# Altium schematic sheet randcomponenten.SchDoc
size A; SheetNumber: 2; SheetTotal: 2
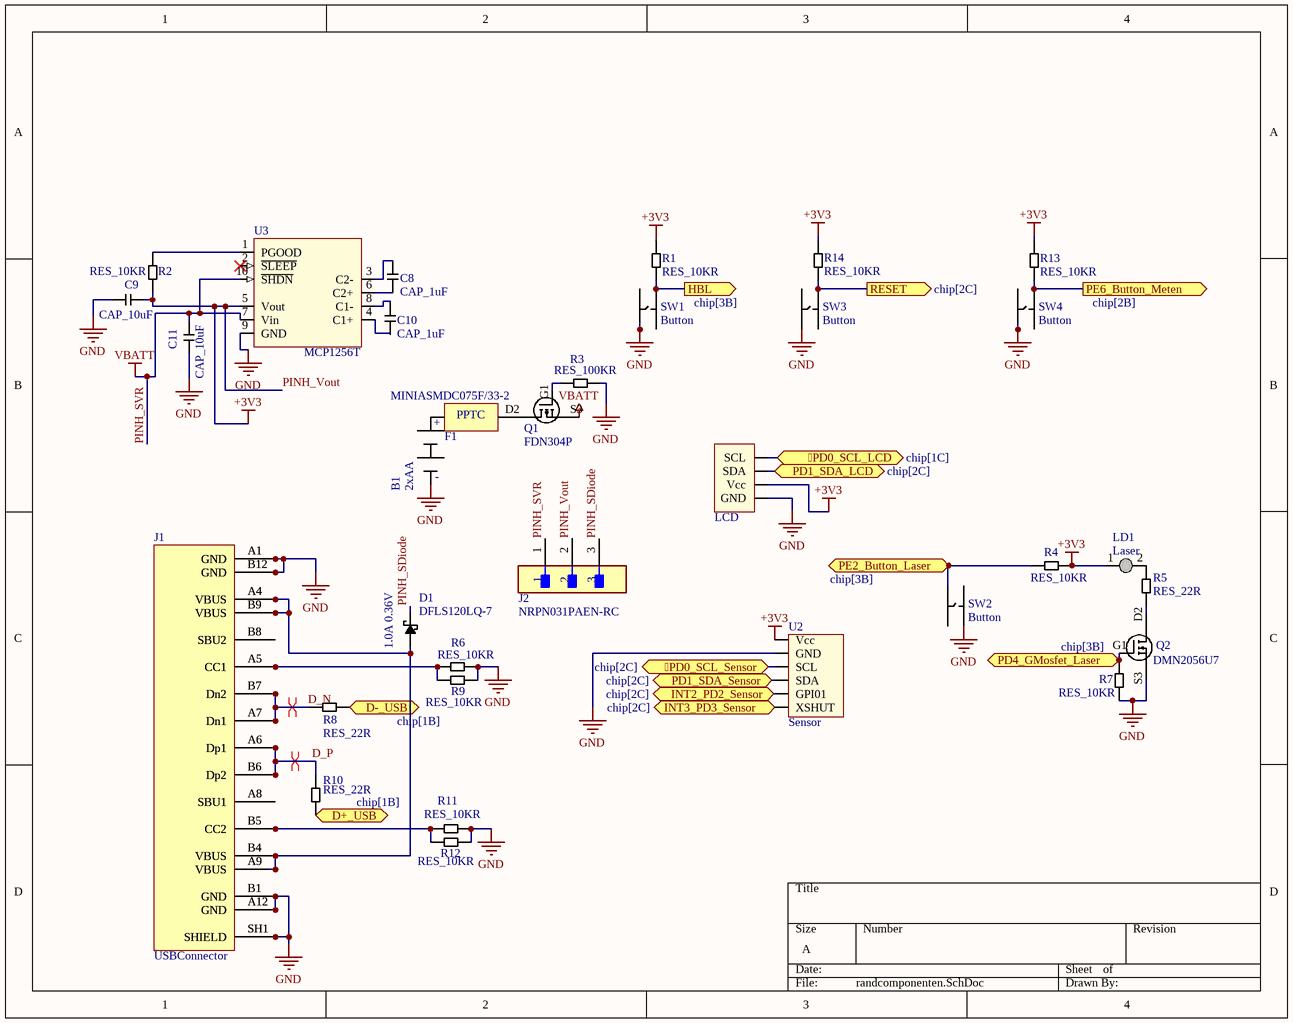
[diagram p0: randcomponenten.SchDoc]

## Parts
B1  2xAA  [BATTERIJHOUDER]
C8  CAP_1uF  [CAP_1uF]
C9  CAP_10uF  [CAP_10uF]
C10  CAP_1uF  [CAP_1uF]
C11  CAP_10uF  [CAP_10uF]
D1  DFLS120LQ-7  [SDIODE]
DS1  LCD  [LCD3V3]
F1  MINIASMDC075F/33-2  [RESC4632X15M]
J1  USBConnector  [USBC]
J2  NRPN031PAEN-RC  [FP-NRPN031PAEN-RC-MFG]
LD1  Laser  [laser]
Q1  FDN304P  [FDN304P]
Q2  DMN2056U7  [DMN2056U-7]
R1  RES_10KR  [RES_10KR]
R2  RES_10KR  [RES_10KR]
R3  RES_100KR  [RES_100KR]
R4  RES_10KR  [RES_10KR]
R5  RES_22R  [RES_22R]
R6  RES_10KR  [RES_10KR]
R7  RES_10KR  [RES_10KR]
R8  RES_22R  [RES_22R]
R9  RES_10KR  [RES_10KR]
R10  RES_22R  [RES_22R]
R11  RES_10KR  [RES_10KR]
R12  RES_10KR  [RES_10KR]
R13  RES_10KR  [RES_10KR]
R14  RES_10KR  [RES_10KR]
SW1  Button  [BUTTON]
SW2  Button  [BUTTON]
SW3  Button  [BUTTON]
SW4  Button  [BUTTON]
U2  Sensor  [Vl53l1x]
U3  MCP1256T  [MCP1256T]

## Ports
PD0_SCL_LCD (bidir, see chip[1C]), PD0_SCL_Sensor (bidir, see chip[2C]), D+_USB (bidir, see chip[1B]), D-_USB (bidir, see chip[1B]), HBL (out, see chip[3B]), INT2_PD2_Sensor (bidir, see chip[2C]), INT3_PD3_Sensor (bidir, see chip[2C]), PD1_SDA_LCD (bidir, see chip[2C]), PD1_SDA_Sensor (bidir, see chip[2C]), PD4_GMosfet_Laser (bidir, see chip[3B]), PE2_Button_Laser (bidir, see chip[3B]), PE6_Button_Meten (out, see chip[2B]), RESET (out, see chip[2C])

## Nets
GND: B1.2 C9.1 C11.1 DS1.4(GND) J1.A1(GND) J1.A12(GND) J1.B1(GND) J1.B12(GND) J1.SH1(SHIELD) Q2.S3(Source) R3.2 R6.1 R7.2 R9.1 R11.1 R12.1 SW1.1 SW2.3 SW3.1 SW4.1 U2.2(GND) U3.9(GND)
PINH_SVR: C11.2 J2.1 Q1.S3(Source) U3.7(Vin) U3.10(~{SHDN})  [also labelled VBATT]
PINH_Vout: C9.2 DS1.3(Vcc) J2.2 LD1.1(+) R1.2 R2.2 R4.2 R13.2 R14.2 U2.1(Vcc) U3.5(Vout)  [also labelled +3V3]
PD0_SCL_LCD: DS1.1(SCL) ; port PD0_SCL_LCD
PD0_SCL_Sensor: U2.3(SCL) ; port PD0_SCL_Sensor
D+_USB: R10.2 ; port D+_USB
D-_USB: R8.1 ; port D-_USB
D_N: J1.A7(Dn1) J1.B7(Dn2) R8.2
D_P: J1.A6(Dp1) J1.B6(Dp2) R10.1
HBL: R1.1 SW1.4 ; port HBL
INT2_PD2_Sensor: U2.5(GPI01) ; port INT2_PD2_Sensor
INT3_PD3_Sensor: U2.6(XSHUT) ; port INT3_PD3_Sensor
PD1_SDA_LCD: DS1.2(SDA) ; port PD1_SDA_LCD
PD1_SDA_Sensor: U2.4(SDA) ; port PD1_SDA_Sensor
PD4_GMosfet_Laser: Q2.G1(Gate) R7.1 ; port PD4_GMosfet_Laser
PE2_Button_Laser: R4.1 SW2.2 ; port PE2_Button_Laser
PE6_Button_Meten: R13.1 SW4.4 ; port PE6_Button_Meten
PINH_SDiode: D1.2 J2.3
RESET: R14.1 SW3.4 ; port RESET
NetB1_1: B1.1 F1.1
NetC8_1: C8.1 U3.6(C2+)
NetC8_2: C8.2 U3.3(C2-)
NetC10_1: C10.1 U3.4(C1+)
NetC10_2: C10.2 U3.8(C1-)
NetD1_1: D1.1 J1.A4(VBUS) J1.A9(VBUS) J1.B4(VBUS) J1.B9(VBUS)
NetF1_2: F1.2 Q1.D2(Drain)
NetJ1_A5: J1.A5(CC1) R6.2 R9.2
NetJ1_B5: J1.B5(CC2) R11.2 R12.2
NetLD1_2: LD1.2(-) R5.2
NetQ1_G1: Q1.G1(Gate) R3.1
NetQ2_D2: Q2.D2(Drain) R5.1
NetR2_1: R2.1 U3.1(PGOOD)

Not connected (* = marked no-connect by the designer): J1 A8(SBU1) B8(SBU2); SW1 2 3; SW2 1 4; SW3 2 3; SW4 2 3; U3 2(~{SLEEP})*

## Layout directives
differential pair: D_N, D_P

## Notes on the sheet
- (in symbol 2xAA) +; -
- (in symbol DFLS120LQ-7) 1.0A 0.36V
- (in symbol MINIASMDC075F/33-2) PPTC

## Library data of the parts
B1 = 2xAA: Batterijhouder
D1 = DFLS120LQ-7: Schottky Diode
F1 = MINIASMDC075F/33-2: Fuse
J1 = USBConnector: pin to pad: A1>A1_B12 A4>A4_B9 A9>B4_A9 A12>B1_A12 B1>B1_A12 B4>B4_A9 B9>A4_B9 B12>A1_B12
J2 = CMP-25680-000021-1: CONN HEADER VERT 3POS 2MM; Manufacturer: Sullins; Number Of Contacts: 3; Conn Orientation: Straight; Voltage Rating: 150V; Conn Gender: Male; Current Rating: 2A; Temperature Range High: +105°C; Category: Conn; Manufacturer Part Number: NRPN031PAEN-RC; RoHS: TRUE; Contact Material: Gold,Nickel; ComponentLink2URL: https://drawings-pdf.s3.amazonaws.com/10531.pdf; Temperature: -40°C to +105°C; Lead Free: Yes; Octopart: https://octopart.com/nrpn031paen-rc-sullins-12817732; ComponentLink2Description: Datasheet; Pitch: 2mm; Number Of Rows: 1; Automotive: No; Height: 6mm; Device Class L2: Headers and Wire Housings; Digikey Description: CONN HEADER VERT 3POS 2MM; Package: 0; Device Class L3: unset; Temperature Range Low: -40°C; Device Class L1: Connectors
Q1 = FDN304P: p-mosfet
Q2 = DMN2056U7: n-mosfet
U3 = MCP1256T: Switching Voltage Regulator